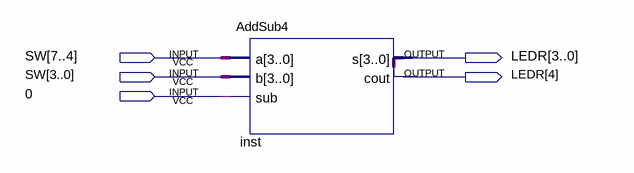
[diagram p0: schematic sheet]
// Quartus schematic AdderDemo.bdf as structural Verilog: 1 symbols, 5 pins
module AdderDemo (
  input  [7:0] SW,
  input  \0 ,
  output [4:0] LEDR
);

  AddSub4 inst (.a(SW[7:4]), .b(SW[3:0]), .sub(\0 ));  // open: s, cout
endmodule
